# Altium schematic sheet gba-zero.SchDoc: gba-zero
size 270 x 269 mm; Origin: Eagle; Date: 30/01/2019 17:25:17; SheetNumber: 1; GateName_1: G$1; SymbolName_1: LETTER_L; LibraryName: frames; DeviceSetName: LETTER_L; GateName_2: G$2; SymbolName_2: DOCFIELD; Sheet: Sheet:; REV: REV:
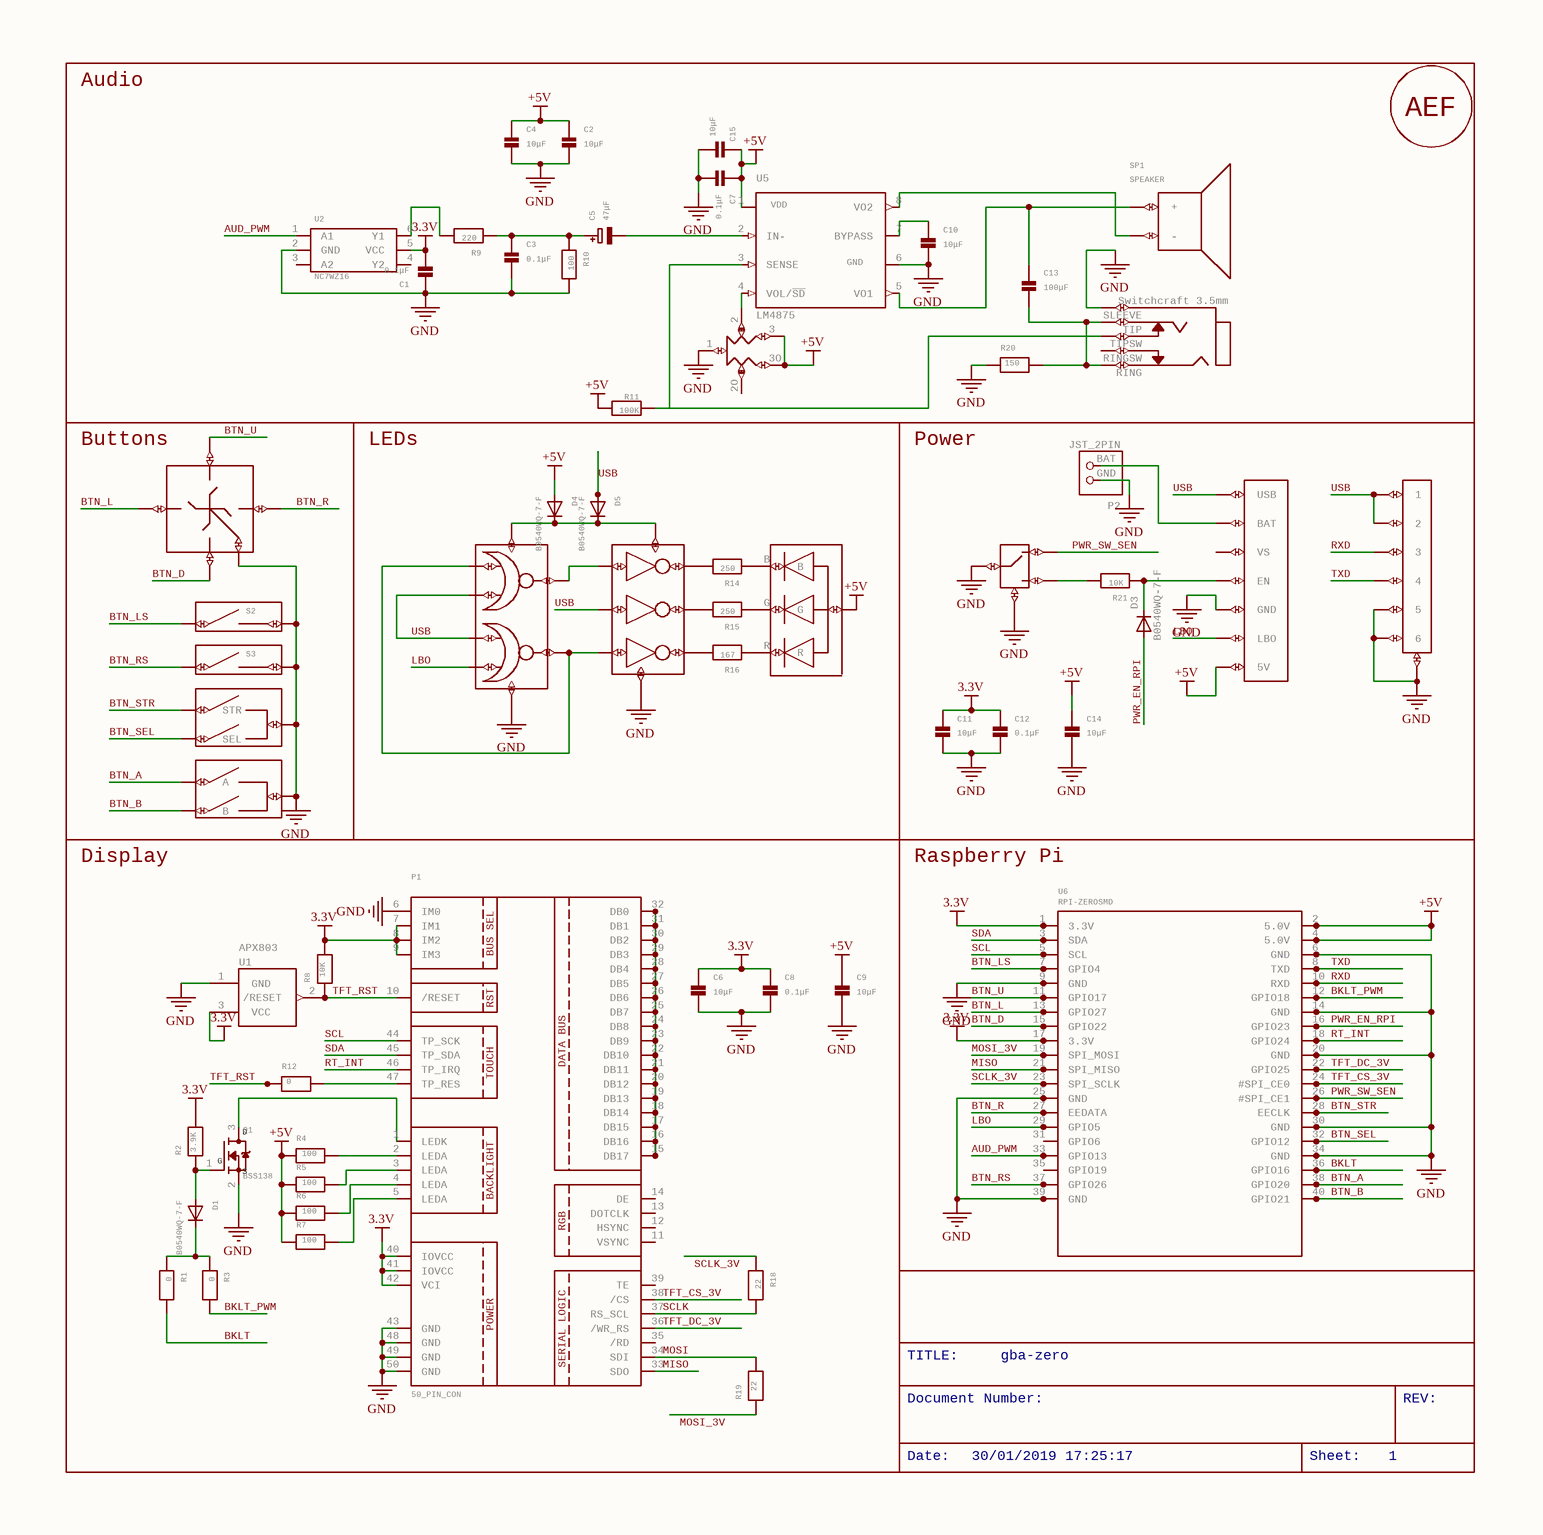
[diagram p0: gba-zero.SchDoc]

## Parts
C1  0.1μF  [0603]
C2  10μF  [0603]
C3  0.1μF  [0603]
C4  10μF  [0603]
C5  47μF  [EIA6032-28/C-R]
C6  10μF  [0603]
C7  0.1μF  [0603]
C8  0.1μF  [0603]
C9  10μF  [0603]
C10  10μF  [0603]
C11  10μF  [0603]
C12  0.1μF  [0603]
C13  100μF  [1206]
C14  10μF  [0603]
C15  10μF  [0603]
D1  B0540WQ-7-F  [SOD-123]
D2  LTST-C19HE1WT  [WL-SBCW-0606]  (value not drawn)
D3  B0540WQ-7-F  [SOD-123]
D4  B0540WQ-7-F  [SOD-123]
D5  B0540WQ-7-F  [SOD-123]
J1  Switchcraft3.5mm: Switchcraft 3.5mm  [4-JACK-SMD]  (hidden comment: SWTCHCRFT_3.5JACK5-JACK-SMD)
P1  50_PIN_CON  BUSSEL: BUS SEL  SERIALLOGIC: SERIAL LOGIC  DATABUS: DATA BUS  [FPC-50-CON]
P2  JST_2PIN  [JSTPH2]
P3  LINK_CONNECTOR  [LINK_CONNECTOR]  (value not drawn)
Q1  BSS138  [SOT23-WIDE]
R1  0  [0603]
R2  3.9K  [0603]
R3  0  [0603]
R4  100  [0603]
R5  100  [0603]
R6  100  [0603]
R7  100  [0603]
R8  10K  [0603]
R9  220  [0603]
R10  100  [0603]
R11  100K  [0603]
R12  0  [0603]
R14  250  [0603]
R15  250  [0603]
R16  167  [0603]
R17  10K  [RK10J12E0A0A]  (value not drawn)
R18  22  [0603]
R19  22  [0603]
R20  150  [0603]
R21  10K  [0603]
S1  D-PAD  [D-PAD]  (value not drawn)
S2  SHOULDER_BUTTON  [SHOULDER_BUTTON]  (value not drawn)
S3  SHOULDER_BUTTON  [SHOULDER_BUTTON]  (value not drawn)
S4  START_SELECT_BUTTON  [START_SELECT_BUTTON]  (value not drawn)
S5  AB_BUTTON  [AB_BUTTON]  (value not drawn)
S6  PWR_SWITCH  [PWR-SWITCH]  (value not drawn)
SP1  SPEAKER  [SPEAKER]
U1  APX803  [SOT23]
U2  NC7WZ16  [SC-70-6]
U3  74LVC2G02  [TSSOP-8]  (value not drawn)
U4  74LVC3G04  [TSSOP-8]  (value not drawn)
U5  LM4875  [SO-8]
U6  RPI-ZEROSMD  [RPI-SMD]
U7  POWERBOOST-1000C  [POWERBOOST-1000C]  (value not drawn)
U$1  SIGNATURE  [SIGNATURE]  (value not drawn)

## Nets
3.3V: C1.2(P$2) C6.1(P$1) C8.1(P$1) C11.1(P$1) C12.1(P$1) P1.7(IM1) P1.8(IM2) P1.9(IM3) P1.40(IOVCC) P1.41(IOVCC) P1.42(VCI) R2.2 R8.2 U1.3(VCC) U2.5(VCC) U6.1(3.3V) U6.17(3.3V)
+5V: C2.1(P$1) C4.1(P$1) C7.1(P$1) C9.1(P$1) C14.1(P$1) C15.1(P$1) D2.VCC D4.A R4.1 R5.1 R6.1 R7.1 R11.2 R17.3 R17.3O U5.1(VDD) U6.2(5.0V) U6.4(5.0V) U7.5V
GND: C1.1(P$1) C2.2(P$2) C3.2(P$2) C4.2(P$2) C6.2(P$2) C7.2(P$2) C8.2(P$2) C9.2(P$2) C10.2(P$2) C11.2(P$2) C12.2(P$2) C14.2(P$2) C15.2(P$2) J1.1 P1.6(IM0) P1.43(GND) P1.48(GND) P1.49(GND) P1.50(GND) P2.GND P3.5 P3.6 P3.GND@1,2(GND) Q1.2(S) R10.2 R17.1 R20.1 S1.GND@1-4(GND) S2.GND@1-3 S3.GND@1-3 S4.GND@1-4(GND) S5.GND@1-4(GND) S6.C@1,2(C) S6.GND@1,2(GND) U1.1(GND) U2.2(GND) U3.4(GND) U4.4(GND) U5.6(GND) U6.6(GND) U6.9(GND) U6.14(GND) U6.20(GND) U6.25(GND) U6.30(GND) U6.34(GND) U6.39(GND) U7.GND@1,2(GND)
AUD_PWM: U2.1(A1) U6.33(GPIO13)
BKLT: R1.2 U6.36(GPIO16)
BKLT_PWM: R3.2 U6.12(GPIO18)
BTN_A: S5.A@1,2(A) U6.38(GPIO20)
BTN_B: S5.B@1,2(B) U6.40(GPIO21)
BTN_D: S1.DOWN U6.15(GPIO22)
BTN_L: S1.LEFT U6.13(GPIO27)
BTN_LS: S2.SW U6.7(GPIO4)
BTN_R: S1.RIGHT U6.27(EEDATA)
BTN_RS: S3.SW U6.37(GPIO26)
BTN_SEL: S4.SEL U6.32(GPIO12)
BTN_STR: S4.STR U6.28(EECLK)
BTN_U: S1.UP U6.11(GPIO17)
LBO: U3.6(2B) U6.29(GPIO5) U7.LBO
MISO: P1.33(SDO) U6.21(SPI_MISO)
MOSI: P1.34(SDI) R19.2
MOSI_3V: R19.1 U6.19(SPI_MOSI)
PWR_EN_RPI: D3.A U6.16(GPIO23)
PWR_SW_SEN: S6.L U6.26(#SPI_CE1)
RT_INT: P1.46(TP_IRQ) U6.18(GPIO24)
RXD: P3.3 U6.10(RXD)
SCL: P1.44(TP_SCK) U6.5(SCL)
SCLK: P1.37(RS_SCL) R18.2
SCLK_3V: R18.1 U6.23(SPI_SCLK)
SDA: P1.45(TP_SDA) U6.3(SDA)
TFT_CS_3V: P1.38(/CS) U6.24(#SPI_CE0)
TFT_DC_3V: P1.36(/WR_RS) U6.22(GPIO25)
TFT_RST: P1.10(/RESET) R8.1 R12.1 U1.2(/RESET)
TXD: P3.4 U6.8(TXD)
USB: D5.A P3.1 P3.2 U3.2(1B) U3.5(2A) U4.3(2A) U7.USB
NetC3_1: C3.1(P$1) C5.+ R9.1 R10.1
NetC5_-: C5.- U5.2(IN-)
NetC10_1: C10.1(P$1) U5.7(BYPASS)
NetC13_1: C13.1(P$1) SP1.1(+) U5.5(VO1)
NetC13_2: C13.2(P$2) J1.2 J1.3 R20.2
NetD1_A: D1.A Q1.1(G) R2.1
NetD1_C: D1.C R1.1 R3.1
NetD2_B: D2.B R14.1
NetD2_G: D2.G R15.1
NetD2_R: D2.R R16.1
NetD3_C: D3.C R21.1 U7.EN
NetD4_C: D4.C D5.C U3.8(VCC) U4.8(VCC)
NetJ1_5: J1.5 R11.1 U5.3(SENSE)
NetP1_1: P1.1(LEDK) Q1.3(D)
NetP1_2: P1.2(LEDA) R4.2
NetP1_3: P1.3(LEDA) R5.2
NetP1_4: P1.4(LEDA) R6.2
NetP1_5: P1.5(LEDA) R7.2
NetP1_15: P1.15(DB17) P1.16(DB16) P1.17(DB15) P1.18(DB14) P1.19(DB13) P1.20(DB12) P1.21(DB11) P1.22(DB10) P1.23(DB9) P1.24(DB8) P1.25(DB7) P1.26(DB6) P1.27(DB5) P1.28(DB4) P1.29(DB3) P1.30(DB2) P1.31(DB1) P1.32(DB0)
NetP1_47: P1.47(TP_RES) R12.2
NetP2_BAT: P2.BAT U7.BAT
NetR9_2: R9.2 U2.6(Y1)
NetR14_2: R14.2 U4.7(1Y)
NetR15_2: R15.2 U4.5(2Y)
NetR16_2: R16.2 U4.2(3Y)
NetR17_2: R17.2 U5.4(VOL/~{SD})
NetR21_2: R21.2 S6.R
NetSP1_2: SP1.2(-) U5.8(VO2)
NetU3_1: U3.1(1A) U3.3(2Y) U4.6(3A)
NetU3_7: U3.7(1Y) U4.1(1A)

Not connected (* = marked no-connect by the designer): J1 4; P1 11(VSYNC) 12(HSYNC) 13(DOTCLK) 14(DE) 35(/RD) 39(TE); R17 2O; U2 3(A2) 4(Y2); U6 31(GPIO6) 35(GPIO19); U7 VS

## Notes on the sheet
- Audio
- (near S1) Buttons
- LEDs
- Power
- Display
- Raspberry Pi
- TITLE:
- Document Number:
- gba-zero
- REV:
- Date:
- 30/01/2019 17:25:17
- Sheet:
- 1

## Library data of the parts
C1-C4 C6-C12 C14 C15 = CAP_CERAMIC0603: Ceramic Capacitors0402 - 0402 Surface Mount Capacitors  16pF 50V 5% [Digikey: 445-4899-2-ND]  18pF 50V 5% [Digikey: 490-1281-2-ND]  22pF 50V 5% [Digikey: 490-1283-2-ND]  68pF 50V 5% [Digikey: 490-1289-2-ND]  0.1uF 10V 10% [Digikey: 490-1318-2-ND]  1.0uF 6.3V 10% [Digikey: 490-1320-2-ND]    0603 - 0603 Surface Mount Capacitors  16 pF 50V 5% [Digikey: 445-5051-2-ND]  22 pF 50V [Digikey: PCC220ACVTR-ND]  33 pF 50V 5% [Digikey: 490-1415-1-ND]  56pF 50V 5% [Digikey: 490-1421-1-ND]  220pF 50V 5% [Digikey: 445-1285-1-ND]  680 pF 50V   2200 pF 50V 5% C0G [Digikey: 445-1297-1-ND]  5600 pF 100V 5% X7R [Digikey: 478-3711-1-ND]  0.1 ÂµF 25V 10% [Digikey: PCC2277TR-ND]  0.22 ÂµF 16V 10% X7R [Digikey: 445-1318-1-ND]  1.0 ÂµF 25V 10% [Digikey: 445-5146-2-ND]    0603 - RF Specific  3pF 250V +/-0.1pF RF [Digikey: 712-1347-1-ND]  18 pF 250V 5%  [Digikey: 478-3505-1-ND or 712-1322-1-ND]  56 pF 250V 5% C0G RF [Digikey: 490-4867-1-ND]  68 pF 250V RF [Digikey: 490-4868-1-ND]    0805 - 0805 Surface Mount Capacitors  220 pF 250V 2% RF Ceramic Capacitor [Digikey: 712-1398-1-ND]  1000 pF 50V 2% NP0 Ceramic Capacitor [Digikey: 478-3760-1-ND]  0.1 ÂµF 25V 10% Ceramic Capacitor [Digikey: PCC1828TR-ND]  1.0 ÂµF 16V 10% Ceramic Capacitor[Digikey: 490-1691-2-ND]  10.0 ÂµF 10V 10% Ceramic Capacitor[Digikey: 709-1228-1-ND]  10.0 uF 16V 10% Ceramic Capacitor [Digikey: 478-5165-2-ND]  47 uF 6.3V 20% Ceramic Capacitor [Digikey: 587-1779-1-ND or 399-5506-1-ND]       1206 - 1206 Surface Mount Capacitors  47uF 10V 20% Ceramic Capacitor [Digikey: 490-5528-1-ND or 399-5508-1-ND or 445-6010-1-ND]  100uF 6.3V -20%, +80% Y5V Ceramic Capacitor (Digikey: 490-4512-1-ND, Mouser: 81-GRM31CF50J107ZE1L); GateName_1: G$1; SymbolName_1: CAPACITOR; DeviceName: 0603; LibraryName: microbuilder; DeviceSetName: CAP_CERAMIC
C5 = CAP_TANTALUMC/6032_REFLOW: Tantalum Capacitors   Wave footprints have larger pads and are meant to be used for hand soldering. Reflow footprints are optimised for solder paste and a reflow oven.EIA3216-18/A-[R/W] - Size A / 3216-18 / 1206 footprint  4.7ÂµF 25V 10% Tantalum Capacitor  10ÂµF 16V 10% Tantalum Capacitor [Digikey: 495-2236-2-ND]    EIA3528-21/B-[R/W] - Size B / 3528-21  47ÂµF 10V 10% Tantalum Capactior [Digikey: 495-2216-1-ND]    EIA6032-28/C-[R/W] - Size C / 6032-28  10ÂµF 35V 20% Tantalum Capacitor [Digikey: 495-2285-1-ND]  100ÂµF 16V 10% Tantalum Capactior [Digikey: 399-5214-1-ND]; GateName_1: G$1; SymbolName_1: CAPACITOR_POL; DeviceName: C/6032_REFLOW; LibraryName: microbuilder; DeviceSetName: CAP_TANTALUM
C13 = CAP_CERAMIC1206: Ceramic Capacitors0402 - 0402 Surface Mount Capacitors  16pF 50V 5% [Digikey: 445-4899-2-ND]  18pF 50V 5% [Digikey: 490-1281-2-ND]  22pF 50V 5% [Digikey: 490-1283-2-ND]  68pF 50V 5% [Digikey: 490-1289-2-ND]  0.1uF 10V 10% [Digikey: 490-1318-2-ND]  1.0uF 6.3V 10% [Digikey: 490-1320-2-ND]    0603 - 0603 Surface Mount Capacitors  16 pF 50V 5% [Digikey: 445-5051-2-ND]  22 pF 50V [Digikey: PCC220ACVTR-ND]  33 pF 50V 5% [Digikey: 490-1415-1-ND]  56pF 50V 5% [Digikey: 490-1421-1-ND]  220pF 50V 5% [Digikey: 445-1285-1-ND]  680 pF 50V   2200 pF 50V 5% C0G [Digikey: 445-1297-1-ND]  5600 pF 100V 5% X7R [Digikey: 478-3711-1-ND]  0.1 ÂµF 25V 10% [Digikey: PCC2277TR-ND]  0.22 ÂµF 16V 10% X7R [Digikey: 445-1318-1-ND]  1.0 ÂµF 25V 10% [Digikey: 445-5146-2-ND]    0603 - RF Specific  3pF 250V +/-0.1pF RF [Digikey: 712-1347-1-ND]  18 pF 250V 5%  [Digikey: 478-3505-1-ND or 712-1322-1-ND]  56 pF 250V 5% C0G RF [Digikey: 490-4867-1-ND]  68 pF 250V RF [Digikey: 490-4868-1-ND]    0805 - 0805 Surface Mount Capacitors  220 pF 250V 2% RF Ceramic Capacitor [Digikey: 712-1398-1-ND]  1000 pF 50V 2% NP0 Ceramic Capacitor [Digikey: 478-3760-1-ND]  0.1 ÂµF 25V 10% Ceramic Capacitor [Digikey: PCC1828TR-ND]  1.0 ÂµF 16V 10% Ceramic Capacitor[Digikey: 490-1691-2-ND]  10.0 ÂµF 10V 10% Ceramic Capacitor[Digikey: 709-1228-1-ND]  10.0 uF 16V 10% Ceramic Capacitor [Digikey: 478-5165-2-ND]  47 uF 6.3V 20% Ceramic Capacitor [Digikey: 587-1779-1-ND or 399-5506-1-ND]       1206 - 1206 Surface Mount Capacitors  47uF 10V 20% Ceramic Capacitor [Digikey: 490-5528-1-ND or 399-5508-1-ND or 445-6010-1-ND]  100uF 6.3V -20%, +80% Y5V Ceramic Capacitor (Digikey: 490-4512-1-ND, Mouser: 81-GRM31CF50J107ZE1L); GateName_1: G$1; SymbolName_1: CAPACITOR; DeviceName: 1206; LibraryName: microbuilder; DeviceSetName: CAP_CERAMIC
D1 D3-D5 = DIODESOD-123: Diode    SMA      Model	  Volts	  Amps	  Type	  Vf	  Vr	  Digikey #	  Notes	     SSA34-E3	  40V	  3A	  Schottky	  480mV @ 3A	  200uA @ 40V	  SSA34-E3/61TGITR-ND	  	     CDBA120-G	  20V	  1A	  Schottky	  500mV @ 1A	  500uA @ 20V	  641-1014-6-ND	  REEL	     MBRA210	  10V	  2A	  Schottky	  350mV @ 2A	  700uA @ 10V	  MBRA210LT3	  	 SOD-123      Model	  Volts	  Amps	  Type	  Vf	  Vr	  Order #	  Notes	     BAT54T1G	  30V	  200mA	  Schottky	  800mV @ 200mA	  2uA @ 25V	  BAT54T1GOSTR-ND	  	     B0530W	  30V	  500mA	  Schottky	  430mV @ 500mA	  130uA @ 30V	  B0530W-FDICT-ND	  REEL	     MBR120	  1A	  20V	  Schottky	  340mV @ 1A	  	  MBR120VLSFT1GOSCT-ND	  	 SOD-323      Model	  Volts	  Amps	  Type	  Vf	  Vr	  Order #	  Notes	     PMEG2005EJ	  20V	  500mA	  Schottky	  355mV @ 500mA	  	  568-4110-1-ND	  	     ZLLS410	  10V	  570mA	  Schottky	  380mV @ 570mA	  	  ZLLS410CT-ND	  	     1N4148WS	  75V	  150mA	  Silicon/Simple	  1V	  	  1N4148WSFSCT-ND	  REEL	 SOD-523      Model	  Volts	  Amps	  Type	  Vf	  Vr	  Order #	  Notes	     BAT54XV2	  30V	  200mA	  Schottky	  0.8V @ 100mA	  	  BAT54XV2CT-ND	  	     TB751S	  30V	  30mA	  Schottky	  	  	  RB751S-40TE61CT-ND	  	 SOT23-R/W (R = Solder Paste/Reflow Ovens, W = Hand-Soldering)       Model	  Volts	  Amps	  Type	  Vf	  Vr	  Order #	  Notes	     BAT54FILM	  40V	  300mA	  Schottky	  	  	  497-7162-1-ND; GateName_1: G$1; SymbolName_1: DIODE; DeviceName: SOD-123; LibraryName: microbuilder; DeviceSetName: DIODE
D2 = LTST-C19HE1WT: GateName_1: G$1; SymbolName_1: LTST-C19HE1WT; LibraryName: gba-zero-parts; DeviceSetName: LTST-C19HE1WT
J1 = SWTCHCRFT_3.5JACK5-JACK-SMD: Switchcraft 3.5mm Stereo Audio Jack manufacturer: 35RASMT4BHNTRX digikey: SC1488-1-ND; GateName_1: G$1; SymbolName_1: SWITCHCRAFT_3.5MM_SMD; DeviceName: 5-JACK-SMD; LibraryName: gba-zero-parts; DeviceSetName: SWTCHCRFT_3.5JACK; SLEEVE: SLEEVE; TIP: TIP; TIPSW: TIPSW; RINGSW: RINGSW; RING: RING
P1 = DISP_LCD_CTP28: 2.83" 240x320 Pixel Capacitive Touch Display; GateName_1: G$1; SymbolName_1: TFT_CTP28_240X320_50PIN; LibraryName: gba-zero-parts; DeviceSetName: DISP_LCD_CTP28; RST: RST; TOUCH: TOUCH; BACKLIGHT: BACKLIGHT; POWER: POWER; RGB: RGB
P2 = JST_2PIN: JST 2-Pin Right-Angle Connector  PH-Series - 4UConnector: 17311  SH-Series - 4UConnector: 07278; GateName_1: G$1; SymbolName_1: PINHD2; LibraryName: gba-zero-parts; DeviceSetName: JST_2PIN
P3 = LINK_CONNECTOR: GateName_1: G$1; SymbolName_1: LINK_CONNECTOR; LibraryName: gba-zero-parts; DeviceSetName: LINK_CONNECTOR
Q1 = MOSFET-NWIDE: N-Channel Mosfet   LEGEND   VDS: Voltage Drain-Source ID: Drain Current RDS(ON): Drain-Source On-State Resistance VGS(TH): Gate-Source Threshold Voltage CISS: Drain-Source Input Capacitance    SOT-23   Name	VDS	ID	RDS(ON)	VGS(TH)	CISS	Order Number	   2N7002E	60V	260mA	2.5 Ohm	2.5V @ 250uA	26.7pF @ 25V	2N7002ET1GOSTR-ND	   BSH103	30V	850mA	400 mOhm	400mV @ 1mA	83pF @ 24V	BSH103,235-ND	   BSS138	60V	320mA	1.6 Ohm	1.5V @ 250uA	50pF @ 10V	Mouser: 771-BSS138PW115	   DMN2075U-7	20V	4.2A	38 mOhm	1V @ 250 uA	594.3pF @ 10V	DMN2075U-7DICT-ND	   							   * BSS138 good choice for I2C level-shifting; GateName_1: G$1; DeviceName: WIDE; SymbolName_1: MOSFET-N; LibraryName: microbuilder; DeviceSetName: MOSFET-N; D: D; S: S; G: G
R1-R12 R14-R16 R18-R21 = RESISTOR0603: Resistors0402 - 0402 Surface Mount Package  22 Ohm 1% 1/16W [Digikey: 311-22.0LRTR-ND]  33 Ohm 5% 1/16W  1.0K 5% 1/16W  1.5K 5% 1/16W  2.0K 1% 1/16W  10.0K 1% 1/16W [Digikey: 311-10.0KLRTR-ND]  10.0K 5% 1/16W [Digikey: RMCF0402JT10K0TR-ND]  12.1K 1% 1/16W [Digikey: 311-22.0LRTR-ND]  100.0K 5% 1/16W    0603 - 0603 Surface Mount Package  0 Ohm 1/10 Watt 1% Resistor  15 Ohm 1/10 Watt 1% Resistor  33 Ohm 1/10 Watt 1% Resistor  49.9 Ohm 1/10 Watt 1% Resistor  100 Ohm 1/10 Watt 1% Resistor  150 Ohm 1/10 Watt 1% Resistor  240 Ohm 1/10 Watt 1% Resistor  390 Ohm 1/10 Watt 1% Resistor  560 Ohm 1/10 Watt 1% Resistor  680 Ohm 1/10 Watt 1% Resistor  750 Ohm 1/10 Watt 1% Resistor  1.0K Ohm 1/10 Watt 1% Resistor  1.5K Ohm 1/10 Watt 1% Resistor  2.0K Ohm 1/10 Watt 1% Resistor  2.2K Ohm 1/10 Watt 1% Resistor  3.3K Ohm 1/10 Watt 1% Resistor  4.7K Ohm 1/10 Watt 1% Resistor  10.0K Ohm 1/10 Watt 1% Resistor  12.0K Ohm 1/10 Watt 1% Resistor  12.1K Ohm 1/10 Watt 1% Resistor  20.0K Ohm 1/10 Watt 1% Resistor  33.0K Ohm 1/10 Watt 1% Resistor  100.0K Ohm 1/10 Watt 1% Resistor    0805 - 0805 Surface Mount Package  0 Ohm 1/8 Watt 1% Resistor  33 Ohm 1/8 Watt 1% Resistor  100 Ohm 1/8 Watt 1% Resistor  150 Ohm 1/8 Watt 1% Resistor  200 Ohm 1/8 Watt 1% Resistor  240 Ohm 1/8 Watt 1% Resistor  330 Ohm 1/8 Watt 1% Resistor  390 Ohm 1/8 Watt 1% Resistor  470 Ohm 1/8 Watt 1% Resistor  1.0K Ohm 1/8 Watt 1% Resistor  1.5K Ohm 1/8 Watt 1% Resistor  2.0K Ohm 1/8 Watt 1% Resistor  4.7K Ohm 1/8 Watt 1% Resistor  5.1K Ohm 1/8 Watt 1% Resistor  5.6K Ohm 1/8 Watt 1% Resistor  10.0K Ohm 1/8 Watt 1% Resistor  22.0K Ohm 1/8 Watt 1% Resistor  33.0K Ohm 1/8 Watt 1% Resistor  100K Ohm 1/8 Watt 1% Resistor    1206 - 1206 Surface Mount Package  2012 - 2010 Surface Mount Package  0.11 Ohm 1/2 Watt 1% Resistor - Digikey: RHM.11UCT-ND; GateName_1: G$1; SymbolName_1: RESISTOR; DeviceName: 0603; LibraryName: microbuilder; DeviceSetName: RESISTOR
R17 = RK10J12E0A0A: GateName_1: G$1; SymbolName_1: RK10J12E0A0A; LibraryName: gba-zero-parts; DeviceSetName: RK10J12E0A0A
S1 = D-PAD: GateName_1: G$1; SymbolName_1: D-PAD; LibraryName: gba-zero-parts; DeviceSetName: D-PAD
S2 S3 = SHOULDER_BUTTON: GateName_1: G$1; SymbolName_1: SHOULDER_BUTTON; LibraryName: gba-zero-parts; DeviceSetName: SHOULDER_BUTTON
S4 = START_SELECT_BUTTON: GateName_1: G$1; SymbolName_1: START_SELECT_BUTTON; LibraryName: gba-zero-parts; DeviceSetName: START_SELECT_BUTTON
S5 = AB_BUTTON: GateName_1: G$1; SymbolName_1: AB_BUTTON; LibraryName: gba-zero-parts; DeviceSetName: AB_BUTTON
S6 = PWR_SWITCH: GateName_1: G$1; SymbolName_1: PWR-SWITCH; LibraryName: gba-zero-parts; DeviceSetName: PWR_SWITCH
SP1 = SPEAKER: GateName_1: SP$1; SymbolName_1: SPEAKER; LibraryName: GBA; DeviceSetName: SPEAKER
U1 = AXP083-SAG: GateName_1: G$1; SymbolName_1: RESET_SUPERVISOR; DeviceName: -SAG; DeviceSetName: AXP083; LibraryName: adafruit
U2 = NC7WZ16: GateName_1: G$1; SymbolName_1: NC7WZ16; LibraryName: fairchild; DeviceSetName: NC7WZ16
U3 = 74LVC2G02: GateName_1: G$1; SymbolName_1: 74LVC2G02DP; LibraryName: gba-zero-parts; DeviceSetName: 74LVC2G02
U4 = 74LVC3G04: GateName_1: G$1; SymbolName_1: 74LVC3G04; LibraryName: gba-zero-parts; DeviceSetName: 74LVC3G04
U5 = LM4875: LM4875    Boomer Audio Power Amplifier 750mW- with DC Volume Control and Headphone Switch; GateName_1: G$1; SymbolName_1: LM4875; LibraryName: gba-zero-parts; DeviceSetName: LM4875; VDD: VDD; GND: GND
U6 = RPI-ZEROSMD: GateName_1: G$1; DeviceName: SMD; SymbolName_1: RPI-ZERO; LibraryName: gba-zero-parts; DeviceSetName: RPI-ZERO
U7 = POWERBOOST-1000C: GateName_1: G$1; SymbolName_1: POWERBOOST-1000C; LibraryName: gba-zero-parts; DeviceSetName: POWERBOOST-1000C
U$1 = SIGNATURE: GateName_1: G$1; SymbolName_1: SIGNATURE; LibraryName: gba-zero-parts; DeviceSetName: SIGNATURE; AEF: AEF